# Altium schematic sheet DAISY_CHAINING.SchDoc
size A4
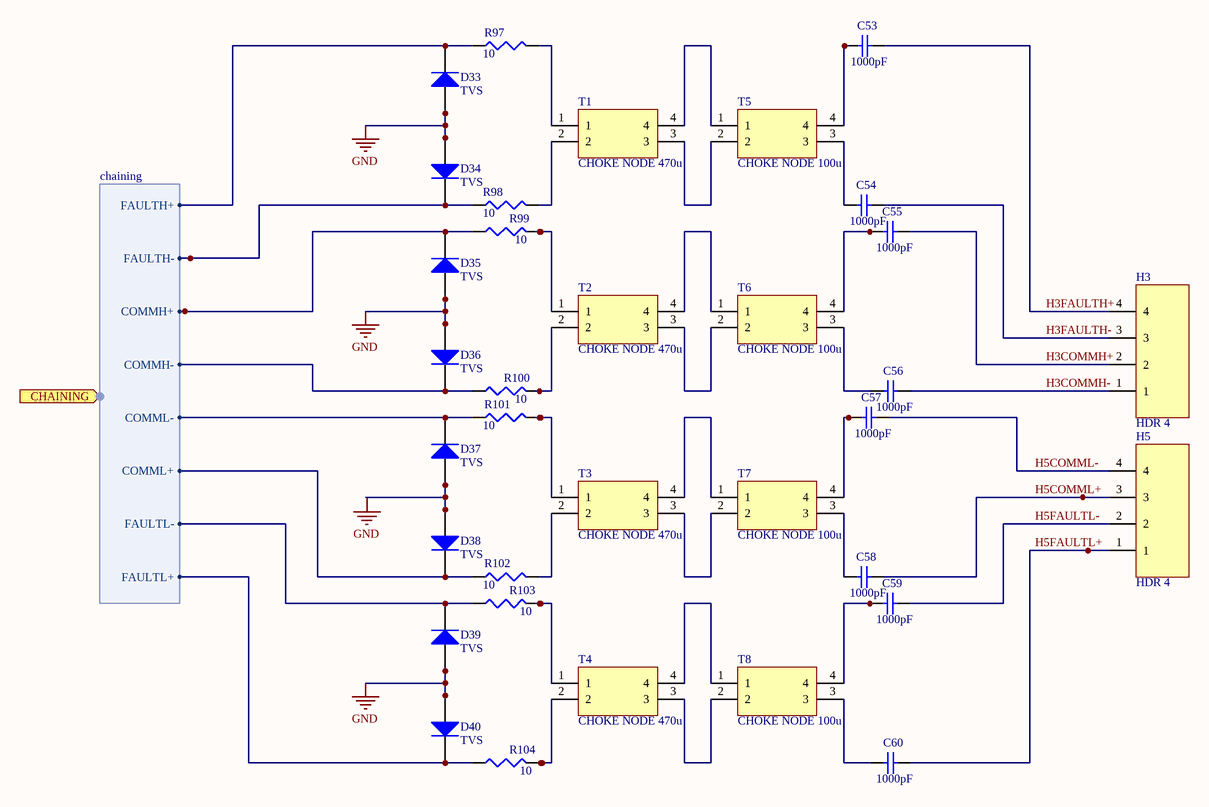
[diagram p0: DAISY_CHAINING.SchDoc]

## Parts
C53  value 1000pF  [1206 CAP]  (hidden comment: Cap Semi)
C54  value 1000pF  [1206 CAP]  (hidden comment: Cap Semi)
C55  value 1000pF  [1206 CAP]  (hidden comment: Cap Semi)
C56  value 1000pF  [1206 CAP]  (hidden comment: Cap Semi)
C57  value 1000pF  [1206 CAP]  (hidden comment: Cap Semi)
C58  value 1000pF  [1206 CAP]  (hidden comment: Cap Semi)
C59  value 1000pF  [1206 CAP]  (hidden comment: Cap Semi)
C60  value 1000pF  [1206 CAP]  (hidden comment: Cap Semi)
D33  TVS  [TVS DIODE]
D34  TVS  [TVS DIODE]
D35  TVS  [TVS DIODE]
D36  TVS  [TVS DIODE]
D37  TVS  [TVS DIODE]
D38  TVS  [TVS DIODE]
D39  TVS  [TVS DIODE]
D40  TVS  [TVS DIODE]
H3  HDR 4  [COMM HDR]
H5  HDR 4  [COMM HDR]
R97  value 10  [1206 RES]  (hidden comment: Res3)
R98  value 10  [1206 RES]  (hidden comment: Res3)
R99  value 10  [1206 RES]  (hidden comment: Res3)
R100  value 10  [1206 RES]  (hidden comment: Res3)
R101  value 10  [1206 RES]  (hidden comment: Res3)
R102  value 10  [1206 RES]  (hidden comment: Res3)
R103  value 10  [1206 RES]  (hidden comment: Res3)
R104  value 10  [1206 RES]  (hidden comment: Res3)
T1  CHOKE NODE 470u  [CHOKE NODE 470u]
T2  CHOKE NODE 470u  [CHOKE NODE 470u]
T3  CHOKE NODE 470u  [CHOKE NODE 470u]
T4  CHOKE NODE 470u  [CHOKE NODE 470u]
T5  CHOKE NODE 100u  [CHOKE NODE 100u]
T6  CHOKE NODE 100u  [CHOKE NODE 100u]
T7  CHOKE NODE 100u  [CHOKE NODE 100u]
T8  CHOKE NODE 100u  [CHOKE NODE 100u]

## Ports
CHAINING (harness chaining)

## Harnesses
chaining: FAULTH+, FAULTH-, COMMH+, COMMH-, COMML+, COMML-, FAULTL-, FAULTL+

## Nets
GND: D33.1(A) D34.1(A) D35.1(A) D36.1(A) D39.1(A) D40.1(A)
H3COMMH+: C55.2 H3.2
H3COMMH-: C56.2 H3.1
H3FAULTH+: C53.2 H3.4
H3FAULTH-: C54.2 H3.3
H5COMML+: C58.2 H5.3
H5COMML-: C57.2 H5.4
H5FAULTL+: C60.2 H5.1
H5FAULTL-: C59.2 H5.2
NetC53_1: C53.1 T5.4
NetC54_1: C54.1 T5.3
NetC55_1: C55.1 T6.4
NetC56_1: C56.1 T6.3
NetC57_1: C57.1 T7.4
NetC58_1: C58.1 T7.3
NetC59_1: C59.1 T8.4
NetC60_1: C60.1 T8.3
NetD33_2: D33.2(K) R97.1
NetD34_2: D34.2(K) R98.1
NetD35_2: D35.2(K) R99.1
NetD36_2: D36.2(K) R100.1
NetD37_1: D37.1(A) D38.1(A)
NetD37_2: D37.2(K) R101.1
NetD38_2: D38.2(K) R102.1
NetD39_2: D39.2(K) R103.1
NetD40_2: D40.2(K) R104.1
NetR97_2: R97.2 T1.1
NetR98_2: R98.2 T1.2
NetR99_2: R99.2 T2.1
NetR100_2: R100.2 T2.2
NetR101_2: R101.2 T3.1
NetR102_2: R102.2 T3.2
NetR103_2: R103.2 T4.1
NetR104_2: R104.2 T4.2
NetT1_3: T1.3 T5.2
NetT1_4: T1.4 T5.1
NetT2_3: T2.3 T6.2
NetT2_4: T2.4 T6.1
NetT3_3: T3.3 T7.2
NetT3_4: T3.4 T7.1
NetT4_3: T4.3 T8.2
NetT4_4: T4.4 T8.1

## Notes on the sheet
- Labels drawn without touching a wire or pin: GND

## Library data of the parts
C53-C60 = Cap Semi: Capacitor (Semiconductor SIM Model); Manufacturer: Yageo; Manufacturer Part Number: CC1206KKX7RCBB102; Description: CAP CER 1000PF 1KV X7R 1206; Dielectric Material: Ceramic; Capacitance: 1nF; Voltage Rating (DC): 1kV; Tolerance: 10%; Dielectric: X7R; Published: 8-Jun-2000; LatestRevisionDate: 29-May-2009; LatestRevisionNote: IPC-7351 Footprint Added.; PackageReference: C1206; Publisher: Altium Limited; PackageDescription: Chip Capacitor; Supplier 1: Digi-Key; Supplier Part Number 1: 311-1144-1-ND; Stock 1: 12559; Pricing 1: 1=0.44, 10=0.304, 100=0.1821, 500=0.1366, 1000=0.1154 (USD); Mount: Surface Mount; Case/Package: 1206; Number of Pins: 2; Weight: 0.000571oz; Case Code (Imperial): 1206; Case Code (Metric): 3216; Min Operating Temperature: -55°C; Max Operating Temperature: 125°C; Packaging: Tape and Reel; Package Quantity: 1; Voltage Rating: 1kV; Termination: SMD/SMT; Composition: Ceramic; Length: 3.2mm; Height: 1.15mm; Width: 1.6mm; Thickness: 0.045inch; Depth: 1.6mm; Radiation Hardening: No; REACH SVHC: No SVHC; Lead Free: Lead Free
D33-D40 = DIODE: Default Diode; Manufacturer: NXP Semiconductors; Manufacturer Part Number: PESD5V0U1UA,115; Description: TVS DIODE 5VWM SOD3232; Direction: Unidirectional; Capacitance: 2.6pF; Number of Channels: 1; Operating Supply Voltage: 5V; Min Breakdown Voltage: 5.8V; Power Line Protection: No; Leakage Current: 100nA; Max Breakdown Voltage: 8.8V; Element Configuration: Single; Published: 8-Jun-2000; LatestRevisionDate: 17-Jul-2002; LatestRevisionNote: Re-released for DXP Platform.; PackageVersion: Sep-1996; PackageReference: SMC; Publisher: Altium Limited; PackageDescription: DO-214-AB/SMC; 2 C-Bend Leads; Body 7.9 x 5.9 mm, inc. leads (LxW); Code_JEDEC: DO-214-AB; Supplier 1: Digi-Key; Supplier Part Number 1: 1727-4155-1-ND; Stock 1: 107363; Pricing 1: 1=0.48, 10=0.36, 100=0.2243, 500=0.1535, 1000=0.1181 (USD); Mount: Surface Mount; Number of Pins: 2; Min Operating Temperature: -55°C; Max Operating Temperature: 150°C; Packaging: Tape and Reel; Package Quantity: 1; Number of Unidirectional Channels: 1; Reverse Standoff Voltage: 5V; Polarity: Unidirectional; Breakdown Voltage: 5.8V; Termination: SMD/SMT; Working Voltage: 5V; Composition: Zener; Length: 1.8mm; Depth: 1.35mm; Radiation Hardening: No; Lead Free: Lead Free
R97-R104 = Res3: Resistor; Manufacturer: Vishay; Manufacturer Part Number: CRCW120610R0FKEA; Description: RES SMD 10 OHM 1% 1/4W 1206; Resistance: 10R; Tolerance: 1%; Power Rating: 250mW; Voltage Rating: 200V; Temperature Coefficient: 100ppm/°C; Published: 8-Jun-2000; LatestRevisionDate: 29-May-2009; LatestRevisionNote: IPC-7351 Footprint Added.; PackageReference: J1-0603; Publisher: Altium Limited; PackageDescription: Chip Resistor; Supplier 1: Digi-Key; Supplier Part Number 1: 541-10.0FCT-ND; Stock 1: 0; Pricing 1: 1=0.1, 10=0.075, 100=0.0304, 1000=0.0136, 2500=0.0118 (USD); Case/Package: 1206; Number of Pins: 2; Weight: 0.000353oz; Case Code (Metric): 3216; Case Code (Imperial): 1206; Contact Plating: Lead,Tin; Min Operating Temperature: -55°C; Max Operating Temperature: 155°C; Packaging: Tape and Reel; Package Quantity: 10; Composition: Thick Film; Termination: SMD/SMT; Military Standard: Not; Voltage Rating (DC): 200V; Number of Terminations: 2; Max Power Dissipation: 250mW; Features: Automotive AEC-Q200; Length: 3.2mm; Height: 0.55mm; Width: 0.063inch; Depth: 1.6mm; Radiation Hardening: No; REACH SVHC: Unknown; Lead Free: Lead Free